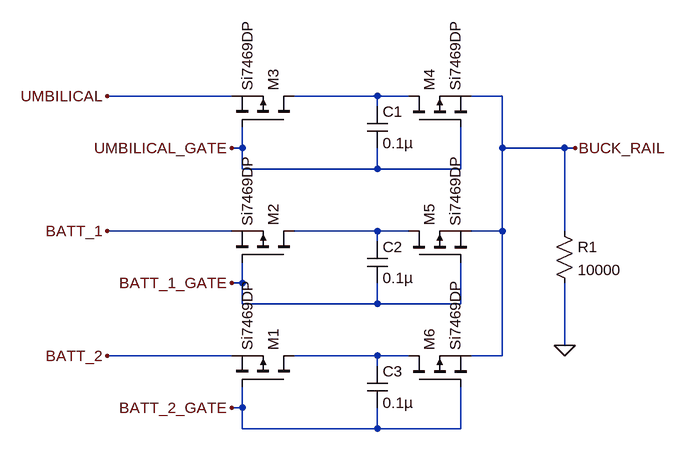
[diagram p0: schematic Draft8.asc]
Draft8.asc, the LTspice schematic file:
Version 4.1
SHEET 1 880 680
WIRE -32 -128 -224 -128
WIRE 192 -128 64 -128
WIRE 240 -128 192 -128
WIRE 384 -128 336 -128
WIRE 192 -112 192 -128
WIRE -16 -48 -16 -80
WIRE -16 -48 -32 -48
WIRE 384 -48 384 -128
WIRE 480 -48 384 -48
WIRE 496 -48 480 -48
WIRE -16 -16 -16 -48
WIRE 192 -16 192 -48
WIRE 192 -16 -16 -16
WIRE 320 -16 320 -80
WIRE 320 -16 192 -16
WIRE -32 80 -224 80
WIRE 192 80 64 80
WIRE 240 80 192 80
WIRE 384 80 384 -48
WIRE 384 80 336 80
WIRE 480 80 480 -48
WIRE 192 96 192 80
WIRE -16 160 -16 128
WIRE -16 160 -32 160
WIRE -16 192 -16 160
WIRE 192 192 192 160
WIRE 192 192 -16 192
WIRE 320 192 320 128
WIRE 320 192 192 192
WIRE 480 256 480 160
WIRE -32 272 -224 272
WIRE 192 272 64 272
WIRE 240 272 192 272
WIRE 384 272 384 80
WIRE 384 272 336 272
WIRE 192 288 192 272
WIRE -16 352 -16 320
WIRE -16 352 -32 352
WIRE -16 384 -16 352
WIRE 192 384 192 352
WIRE 192 384 -16 384
WIRE 320 384 320 320
WIRE 320 384 192 384
FLAG -224 -128 UMBILICAL
FLAG -32 -48 UMBILICAL_GATE
FLAG 496 -48 BUCK_RAIL
FLAG -224 80 BATT_1
FLAG -224 272 BATT_2
FLAG -32 352 BATT_2_GATE
FLAG -32 160 BATT_1_GATE
FLAG 480 256 0
SYMBOL cap 176 -112 R0
SYMATTR InstName C1
SYMATTR Value 0.1µ
SYMBOL cap 176 96 R0
SYMATTR InstName C2
SYMATTR Value 0.1µ
SYMBOL pmos 64 320 M270
WINDOW 3 56 72 Left 0
SYMATTR Value Si7469DP
SYMATTR InstName M1
SYMBOL cap 176 288 R0
SYMATTR InstName C3
SYMATTR Value 0.1µ
SYMBOL res 464 64 R0
SYMATTR InstName R1
SYMATTR Value 10000
SYMBOL pmos 64 128 M270
WINDOW 3 56 72 Left 0
SYMATTR Value Si7469DP
SYMATTR InstName M2
SYMBOL pmos 64 -80 M270
WINDOW 3 56 72 Left 0
SYMATTR Value Si7469DP
SYMATTR InstName M3
SYMBOL pmos 240 -80 R270
WINDOW 3 56 72 Left 0
SYMATTR Value Si7469DP
SYMATTR InstName M4
SYMBOL pmos 240 128 R270
WINDOW 3 56 72 Left 0
SYMATTR Value Si7469DP
SYMATTR InstName M5
SYMBOL pmos 240 320 R270
WINDOW 3 56 72 Left 0
SYMATTR Value Si7469DP
SYMATTR InstName M6

The netlist it stands for:
* Draft8.asc
C1 N001 UMBILICAL_GATE 0.1µ
C2 N002 BATT_1_GATE 0.1µ
M1 N003 BATT_2_GATE BATT_2 BATT_2 Si7469DP
C3 N003 BATT_2_GATE 0.1µ
R1 BUCK_RAIL 0 10000
M2 N002 BATT_1_GATE BATT_1 BATT_1 Si7469DP
M3 N001 UMBILICAL_GATE UMBILICAL UMBILICAL Si7469DP
M4 N001 UMBILICAL_GATE BUCK_RAIL BUCK_RAIL Si7469DP
M5 N002 BATT_1_GATE BUCK_RAIL BUCK_RAIL Si7469DP
M6 N003 BATT_2_GATE BUCK_RAIL BUCK_RAIL Si7469DP
.model NMOS NMOS
.model PMOS PMOS
.lib standard.mos
.backanno
.end